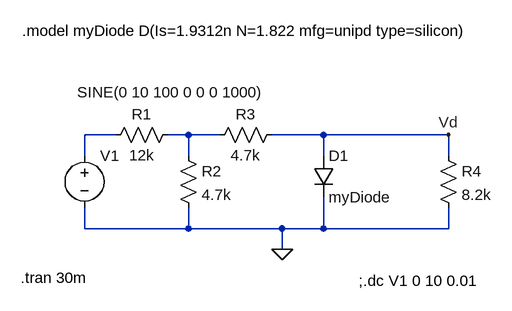
[diagram p0: schematic circuito_2_lab_1.asc]
circuito_2_lab_1.asc, the LTspice schematic file:
Version 4
SHEET 1 880 680
WIRE -48 96 -96 96
WIRE 64 96 32 96
WIRE 112 96 64 96
WIRE 272 96 192 96
WIRE 464 96 272 96
WIRE -96 128 -96 96
WIRE 64 128 64 96
WIRE 272 128 272 96
WIRE 464 128 464 96
WIRE -96 240 -96 208
WIRE 64 240 64 208
WIRE 64 240 -96 240
WIRE 208 240 64 240
WIRE 272 240 272 192
WIRE 272 240 208 240
WIRE 464 240 464 208
WIRE 464 240 272 240
WIRE 208 272 208 240
FLAG 208 272 0
FLAG 464 96 Vd
SYMBOL voltage -96 112 R0
WINDOW 3 -11 -82 Left 2
WINDOW 123 0 0 Left 0
WINDOW 39 0 0 Left 0
SYMATTR Value SINE(0 10 100 0 0 0 1000)
SYMATTR InstName V1
SYMBOL res 48 112 R0
SYMATTR InstName R2
SYMATTR Value 4.7k
SYMBOL res 48 80 R90
WINDOW 0 0 56 VBottom 2
WINDOW 3 32 56 VTop 2
SYMATTR InstName R1
SYMATTR Value 12k
SYMBOL res 208 80 R90
WINDOW 0 0 56 VBottom 2
WINDOW 3 32 56 VTop 2
SYMATTR InstName R3
SYMATTR Value 4.7k
SYMBOL res 448 112 R0
SYMATTR InstName R4
SYMATTR Value 8.2k
SYMBOL diode 256 128 R0
SYMATTR InstName D1
SYMATTR Value myDiode
TEXT 326 320 Left 2 !;.dc V1 0 10 0.01
TEXT -192 -64 Left 2 !.model myDiode D(Is=1.9312n N=1.822 mfg=unipd type=silicon)
TEXT -194 316 Left 2 !.tran 30m

The netlist it stands for:
* circuito_2_lab_1.asc
V1 N001 0 SINE(0 10 100 0 0 0 1000)
R2 N002 0 4.7k
R1 N002 N001 12k
R3 Vd N002 4.7k
R4 Vd 0 8.2k
D1 Vd 0 myDiode
.model D D
.lib standard.dio
;.dc V1 0 10 0.01
.model myDiode D(Is=1.9312n N=1.822 mfg=unipd type=silicon)
.tran 30m
.backanno
.end